# Altium project PICHeaderBoard.PrjPcb
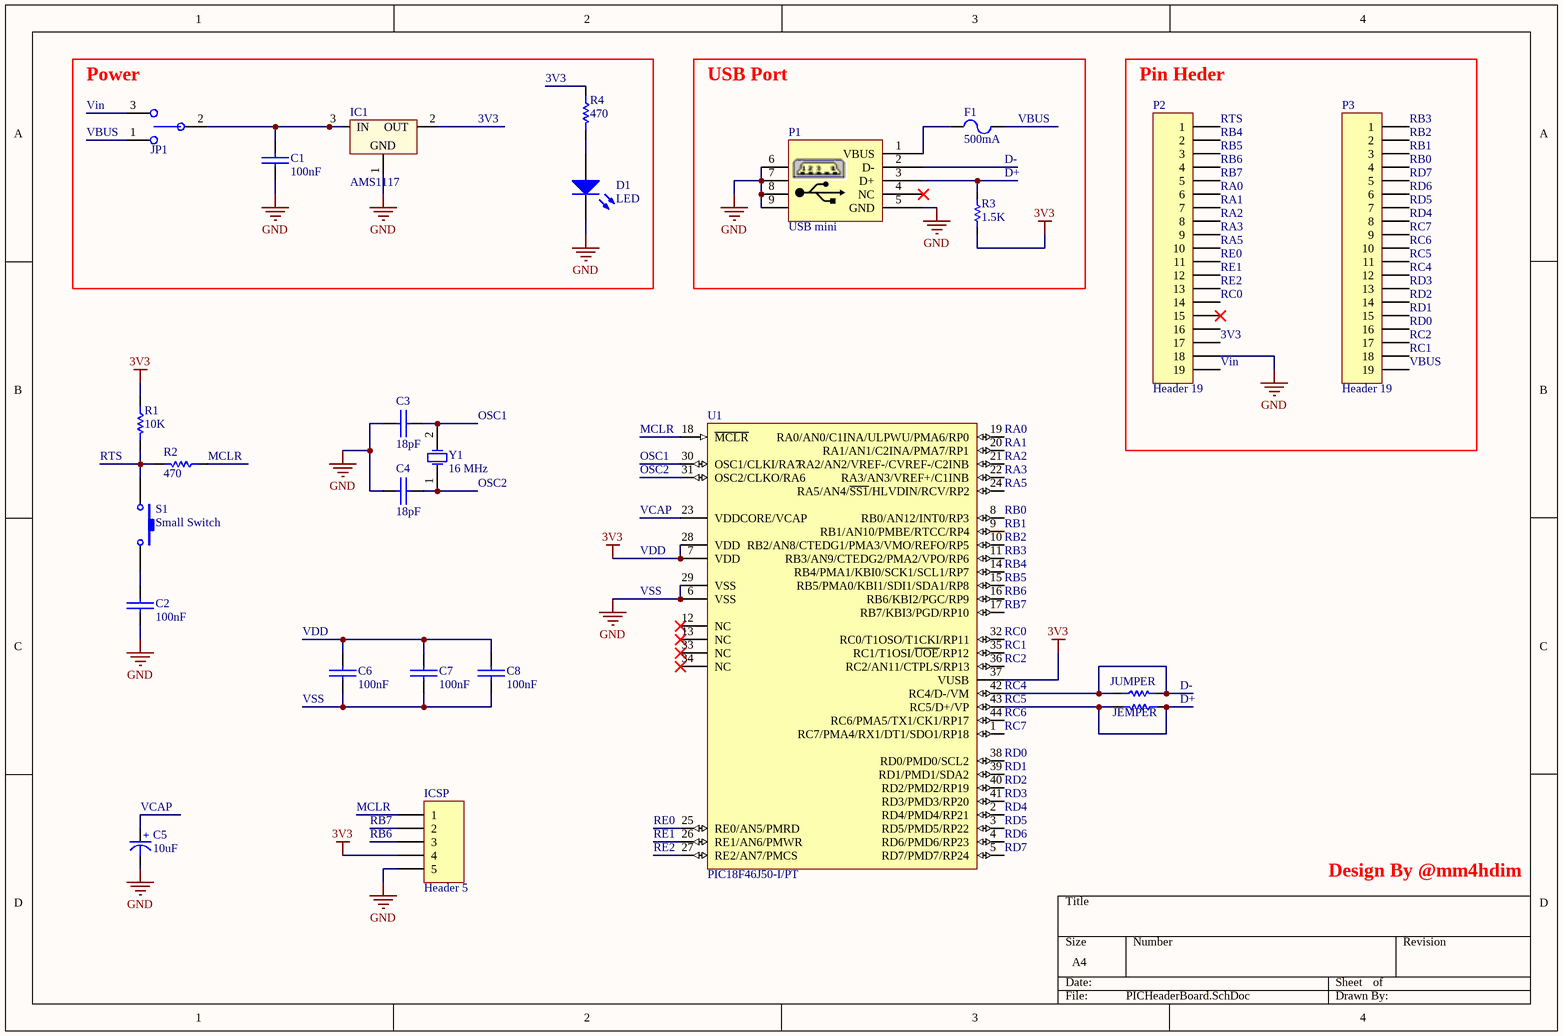
[diagram p0: PICHeaderBoard.SchDoc]
1 sheet, 25 parts. Net scope: global (net labels, ports and power ports of the same name join across sheets).
Board file: PICHeaderBoard.PcbDoc

## Sheet PICHeaderBoard.SchDoc
size A4

### Parts
C1  100nF  [SMD_CAP_0805]
C2  100nF  [SMD_CAP_0805]
C3  18pF  [SMD_CAP_0805]
C4  18pF  [SMD_CAP_0805]
C5  10uF  [TANTAL-CAP-Size A]
C6  100nF  [SMD_CAP_0805]
C7  100nF  [SMD_CAP_0805]
C8  100nF  [SMD_CAP_0805]
D1  LED  [LED]
F1  500mA  [SMD_RES_1206]
IC1  AMS1117  [SOT223]
ICSP  Header 5  [HDR1X5]
J1  JUMPER  [SMD_RES_0603]
J2  JEMPER  [SMD_RES_0603]
JP1  Jumper Selector  [Jumper Selector]  (value not drawn)
P1  USB mini  [USB/SM0.8-6H5]
P2  Header 19  [HDR1X19]
P3  Header 19  [HDR1X19]
R1  10K  [SMD_RES_0805]
R2  470  [SMD_RES_0805]
R3  1.5K  [SMD_RES_0805]
R4  470  [SMD_RES_0805]
S1  Small Switch  [Small Switch]
U1  PIC18F46J50-I/PT  [TQFP-PT44_N]
Y1  16 MHz  [XTAL Small]

### Blocks framed on the sheet
Power: C1 D1 IC1 JP1 R4
USB Port: F1 P1 R3
Pin Heder: P2 P3

### Nets
3V3: C6.1(+) C7.1(+) C8.1(+) IC1.2(OUT) ICSP.4 P2.17 R1.1 R3.1 R4.1 U1.7(VDD) U1.28(VDD) U1.37(VUSB)  [also labelled VDD]
VSS: C1.2(-) C2.2(-) C3.1(+) C4.1(+) C5.1(-) C6.2(-) C7.2(-) C8.2(-) D1.2(K) IC1.1(GND) ICSP.5 P1.5(GND) P1.6 P1.7 P1.8 P1.9 P2.18 U1.6(VSS) U1.29(VSS)  [also labelled GND]
D+: J2.1 J2.2 P1.3(D+) P3.11 R3.2 U1.43(RC5/D+/VP)  [also labelled RC5]
D-: J1.1 J1.2 P1.2(D-) P3.12 U1.42(RC4/D-/VM)  [also labelled RC4]
MCLR: ICSP.1 R2.1 U1.18(~{MCLR})
OSC1: C3.2(-) U1.30(OSC1/CLKI/RA7) Y1.2(OSC2)
OSC2: C4.2(-) U1.31(OSC2/CLKO/RA6) Y1.1(OSC1)
RA0: P2.6 U1.19(RA0/AN0/C1INA/ULPWU/PMA6/RP0)
RA1: P2.7 U1.20(RA1/AN1/C2INA/PMA7/RP1)
RA2: P2.8 U1.21(RA2/AN2/VREF-/CVREF-/C2INB)
RA3: P2.9 U1.22(RA3/AN3/VREF+/C1INB)
RA5: P2.10 U1.24(RA5/AN4/~{SS1}/HLVDIN/RCV/RP2)
RB0: P3.4 U1.8(RB0/AN12/INT0/RP3)
RB1: P3.3 U1.9(RB1/AN10/PMBE/RTCC/RP4)
RB2: P3.2 U1.10(RB2/AN8/CTEDG1/PMA3/VMO/REFO/RP5)
RB3: P3.1 U1.11(RB3/AN9/CTEDG2/PMA2/VPO/RP6)
RB4: P2.2 U1.14(RB4/PMA1/KBI0/SCK1/SCL1/RP7)
RB5: P2.3 U1.15(RB5/PMA0/KBI1/SDI1/SDA1/RP8)
RB6: ICSP.3 P2.4 U1.16(RB6/KBI2/PGC/RP9)
RB7: ICSP.2 P2.5 U1.17(RB7/KBI3/PGD/RP10)
RC0: P2.14 U1.32(RC0/T1OSO/T1CKI/RP11)
RC1: P3.18 U1.35(RC1/T1OSI/~{UOE}/RP12)
RC2: P3.17 U1.36(RC2/AN11/CTPLS/RP13)
RC6: P3.10 U1.44(RC6/PMA5/TX1/CK1/RP17)
RC7: P3.9 U1.1(RC7/PMA4/RX1/DT1/SDO1/RP18)
RD0: P3.16 U1.38(RD0/PMD0/SCL2)
RD1: P3.15 U1.39(RD1/PMD1/SDA2)
RD2: P3.14 U1.40(RD2/PMD2/RP19)
RD3: P3.13 U1.41(RD3/PMD3/RP20)
RD4: P3.8 U1.2(RD4/PMD4/RP21)
RD5: P3.7 U1.3(RD5/PMD5/RP22)
RD6: P3.6 U1.4(RD6/PMD6/RP23)
RD7: P3.5 U1.5(RD7/PMD7/RP24)
RE0: P2.11 U1.25(RE0/AN5/PMRD)
RE1: P2.12 U1.26(RE1/AN6/PMWR)
RE2: P2.13 U1.27(RE2/AN7/PMCS)
RTS: P2.1 R1.2 R2.2 S1.1
VBUS: F1.2 JP1.1 P3.19
VCAP: C5.2(+) U1.23(VDDCORE/VCAP)
Vin: JP1.3 P2.19
NetC1_1: C1.1(+) IC1.3(IN) JP1.2
NetC2_1: C2.1(+) S1.2
NetD1_1: D1.1(A) R4.2
NetF1_1: F1.1 P1.1(VBUS)

Not connected (* = marked no-connect by the designer): P1 4(NC)*; P2 15* 16; U1 12(NC)* 13(NC)* 33(NC)* 34(NC)*

### Notes on the sheet
- Design By @mm4hdim

### Library data of the parts
C1-C4 C6-C8 = Cap-Bipolar: Bipolar Capacitor; Voltage: 100V; Designer: Saeid Jorablo; Organazation: ControTec; Adding Date: 1387/12/20
  C1 C2 C6-C8: Value: 100nF
  C3 C4: Value: 18pF
C5 = Capacitor Electrolytic: Electrolytic Capacitor; value: 10uF
F1 = Fuse
ICSP = Header 5: Header, 5-Pin; LatestRevisionDate: 17-Jul-2002; LatestRevisionNote: Re-released for DXP Platform.; Publisher: Altium Limited
J1 J2 = Resistor: Value: 0K; Tolerance: 5%; Power: 1/8 W
P1 = USB mini: mini USB Connector
P2 P3 = Header 19: Header, 19-Pin; LatestRevisionDate: 17-Jul-2002; LatestRevisionNote: Re-released for DXP Platform.; Publisher: Altium Limited
R1 R2 R4 = Resistor: Tolerance: 5%; Power: 1/8 W
  R1: Value: 10K
  R2 R4: Value: 470
R3 = Resistor: Tolerance: 5%; Power: 1/4 W; Value: 1.5K
U1 = PIC18F46J50-I/PT: Low Power, High Performance USB Microcontroller with nanoWatt XLP Technology, 44-pin TQFP, Industrial Temperature; Published: 2-Dec-2009; DatasheetVersion: revC, Oct-2009; PackageVersion: revBB, Aug-2009; PackageReference: TQFP-PT44; Publisher: Altium Limited; PackageDescription: 44-Lead Plastic Thin Quad Flatpack (PT) - 10x10x1mm Body, 2.00mm [TQFP]; Supplier 1: Digi-Key; Supplier Part Number 1: PIC18F46J50-I/PT-ND; Supplier 2: Farnell; Supplier Part Number 2: 1706312; Code_JEDEC: MS-026; ComponentLink1Description: Datasheet; ComponentLink1URL: http://ww1.microchip.com/downloads/en/DeviceDoc/39931c.pdf; ComponentLink2Description: Packaging Specification; ComponentLink2URL: http://www.microchip.com/stellent/groups/techpub_sg/documents/packagingspec/en012702.pdf; ComponentLink3Description: Microchip.com Home; ComponentLink3URL: http://www.microchip.com/
Y1 = XTAL: XTAL Crystal; Company: E.P.I.L; Design Date: 11/04/2011; Value: 16 MHz
D1 = LED: Published: 8-Jun-2000; LatestRevisionDate: 08-Jul-2005; LatestRevisionNote: Mech Layer 1 removed.; PackageReference: LED-0; Publisher: Altium Limited; PackageDescription: LED; 2 Leads